# Altium schematic sheet nixie_board.SCHDOC
size A2
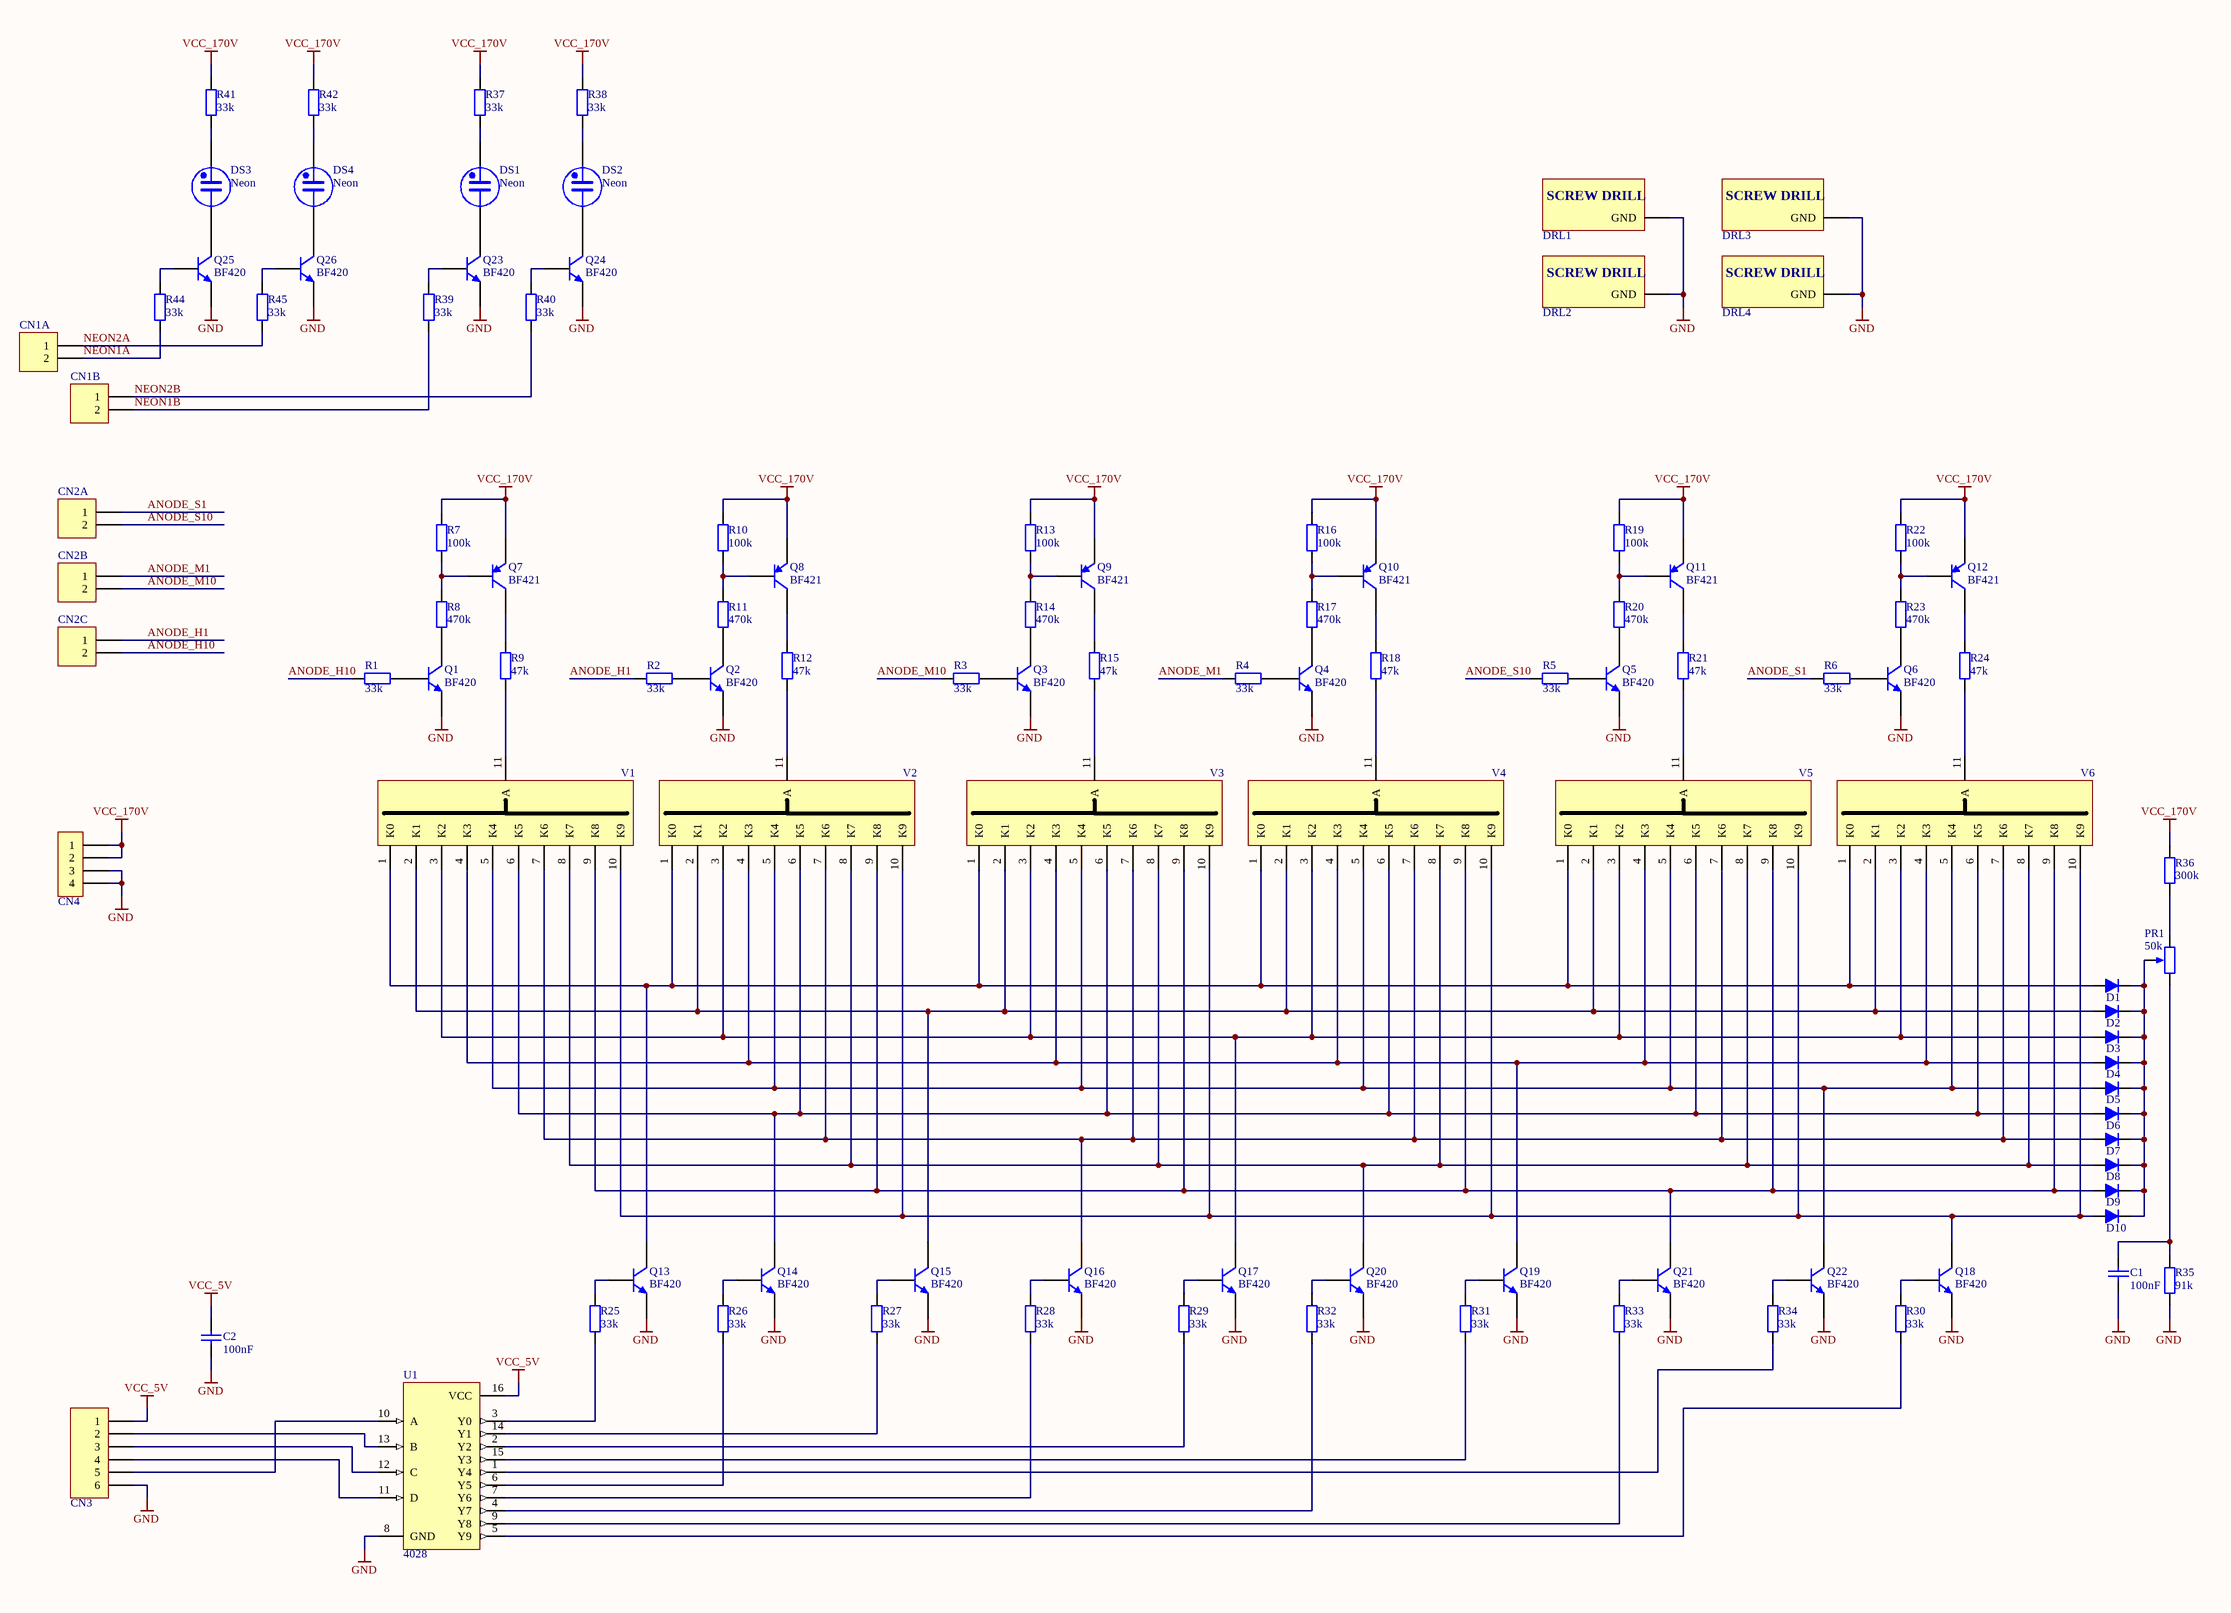
[diagram p0: nixie_board.SCHDOC]

## Parts
C1  100nF  [C-RM5]
C2  100nF  [C-RM5]
CN1A  (no value)  [GP2x1_maual]
CN1B  (no value)  [GP2x1_maual]
CN2A  (no value)  [GP2x1_maual]
CN2B  (no value)  [GP2x1_maual]
CN2C  (no value)  [GP2x1_maual]
CN3  GP 6X1  [GP6x1_manual]  (value not drawn)
CN4  (no value)  [GP4x1_MANUAL]
D1  (no value)  [DO35_LONG]
D2  (no value)  [DO35_LONG]
D3  (no value)  [DO35_LONG]
D4  (no value)  [DO35_LONG]
D5  (no value)  [DO35_LONG]
D6  (no value)  [DO35_LONG]
D7  (no value)  [DO35_LONG]
D8  (no value)  [DO35_LONG]
D9  (no value)  [DO35_LONG]
D10  (no value)  [DO35_LONG]
DRL1  SCREW DRILL  [3mm screw drill I]  (value not drawn)
DRL2  SCREW DRILL  [3mm screw drill I]  (value not drawn)
DRL3  SCREW DRILL  [3mm screw drill I]  (value not drawn)
DRL4  SCREW DRILL  [3mm screw drill I]  (value not drawn)
DS1  Neon  [NEON_6mm]
DS2  Neon  [NEON_6mm]
DS3  Neon  [NEON_6mm]
DS4  Neon  [NEON_6mm]
PR1  50k  [CA6V]
Q1  BF420  [TO-92]
Q2  BF420  [TO-92]
Q3  BF420  [TO-92]
Q4  BF420  [TO-92]
Q5  BF420  [TO-92]
Q6  BF420  [TO-92]
Q7  BF421  [TO-92]
Q8  BF421  [TO-92]
Q9  BF421  [TO-92]
Q10  BF421  [TO-92]
Q11  BF421  [TO-92]
Q12  BF421  [TO-92]
Q13  BF420  [TO-92]
Q14  BF420  [TO-92]
Q15  BF420  [TO-92]
Q16  BF420  [TO-92]
Q17  BF420  [TO-92]
Q18  BF420  [TO-92]
Q19  BF420  [TO-92]
Q20  BF420  [TO-92]
Q21  BF420  [TO-92]
Q22  BF420  [TO-92]
Q23  BF420  [TO-92]
Q24  BF420  [TO-92]
Q25  BF420  [TO-92]
Q26  BF420  [TO-92]
R1  33k  [R10-2]
R2  33k  [R10-2]
R3  33k  [R10-2]
R4  33k  [R10-2]
R5  33k  [R10-2]
R6  33k  [R10-2]
R7  100k  [R10-2]
R8  470k  [R10-2]
R9  47k  [R10-2]
R10  100k  [R10-2]
R11  470k  [R10-2]
R12  47k  [R10-2]
R13  100k  [R10-2]
R14  470k  [R10-2]
R15  47k  [R10-2]
R16  100k  [R10-2]
R17  470k  [R10-2]
R18  47k  [R10-2]
R19  100k  [R10-2]
R20  470k  [R10-2]
R21  47k  [R10-2]
R22  100k  [R10-2]
R23  470k  [R10-2]
R24  47k  [R10-2]
R25  33k  [R10-2]
R26  33k  [R10-2]
R27  33k  [R10-2]
R28  33k  [R10-2]
R29  33k  [R10-2]
R30  33k  [R10-2]
R31  33k  [R10-2]
R32  33k  [R10-2]
R33  33k  [R10-2]
R34  33k  [R10-2]
R35  91k  [R10-2]
R36  300k  [R10-2]
R37  33k  [R10-2]
R38  33k  [R10-2]
R39  33k  [R10-2]
R40  33k  [R10-2]
R41  33k  [R10-2]
R42  33k  [R10-2]
R44  33k  [R10-2]
R45  33k  [R10-2]
U1  4028  [DIP16_MANUAL]
V1  Nixie Tube  [LC516_NIXIE_TUBE]  (value not drawn)
V2  Nixie Tube  [LC516_NIXIE_TUBE]  (value not drawn)
V3  Nixie Tube  [LC516_NIXIE_TUBE]  (value not drawn)
V4  Nixie Tube  [LC516_NIXIE_TUBE]  (value not drawn)
V5  Nixie Tube  [LC516_NIXIE_TUBE]  (value not drawn)
V6  Nixie Tube  [LC516_NIXIE_TUBE]  (value not drawn)

## Nets
GND: C1.1 C2.1 CN3.6 CN4.3 CN4.4 DRL1.0(GND) DRL2.0(GND) DRL3.0(GND) DRL4.0(GND) Q1.1(E) Q2.1(E) Q3.1(E) Q4.1(E) Q5.1(E) Q6.1(E) Q13.1(E) Q14.1(E) Q15.1(E) Q16.1(E) Q17.1(E) Q18.1(E) Q19.1(E) Q20.1(E) Q21.1(E) Q22.1(E) Q23.1(E) Q24.1(E) Q25.1(E) Q26.1(E) R35.1 U1.8(GND)
VCC_5V: C2.2 CN3.1 U1.16(VCC)
VCC_170V: CN4.1 CN4.2 Q7.1(E) Q8.1(E) Q9.1(E) Q10.1(E) Q11.1(E) Q12.1(E) R7.2 R10.2 R13.2 R16.2 R19.2 R22.2 R36.2 R37.2 R38.2 R41.2 R42.2
ANODE_H1: CN2C.1 R2.1
ANODE_H10: CN2C.2 R1.1
ANODE_M1: CN2B.1 R4.1
ANODE_M10: CN2B.2 R3.1
ANODE_S1: CN2A.1 R6.1
ANODE_S10: CN2A.2 R5.1
NEON1A: CN1A.2 R44.2
NEON1B: CN1B.2 R39.2
NEON2A: CN1A.1 R45.2
NEON2B: CN1B.1 R40.2
NetC1_2: C1.2 PR1.2(BOT) R35.2
NetCN3_2: CN3.2 U1.13(B)
NetCN3_3: CN3.3 U1.12(C)
NetCN3_4: CN3.4 U1.11(D)
NetCN3_5: CN3.5 U1.10(A)
NetD1_1: D1.1(A) Q13.2(C) V1.1(K0) V2.1(K0) V3.1(K0) V4.1(K0) V5.1(K0) V6.1(K0)
NetD1_2: D1.2(K) D2.2(K) D3.2(K) D4.2(K) D5.2(K) D6.2(K) D7.2(K) D8.2(K) D9.2(K) D10.2(K) PR1.3(TAP)
NetD2_1: D2.1(A) Q15.2(C) V1.2(K1) V2.2(K1) V3.2(K1) V4.2(K1) V5.2(K1) V6.2(K1)
NetD3_1: D3.1(A) Q17.2(C) V1.3(K2) V2.3(K2) V3.3(K2) V4.3(K2) V5.3(K2) V6.3(K2)
NetD4_1: D4.1(A) Q19.2(C) V1.4(K3) V2.4(K3) V3.4(K3) V4.4(K3) V5.4(K3) V6.4(K3)
NetD5_1: D5.1(A) Q22.2(C) V1.5(K4) V2.5(K4) V3.5(K4) V4.5(K4) V5.5(K4) V6.5(K4)
NetD6_1: D6.1(A) Q14.2(C) V1.6(K5) V2.6(K5) V3.6(K5) V4.6(K5) V5.6(K5) V6.6(K5)
NetD7_1: D7.1(A) Q16.2(C) V1.7(K6) V2.7(K6) V3.7(K6) V4.7(K6) V5.7(K6) V6.7(K6)
NetD8_1: D8.1(A) Q20.2(C) V1.8(K7) V2.8(K7) V3.8(K7) V4.8(K7) V5.8(K7) V6.8(K7)
NetD9_1: D9.1(A) Q21.2(C) V1.9(K8) V2.9(K8) V3.9(K8) V4.9(K8) V5.9(K8) V6.9(K8)
NetD10_1: D10.1(A) Q18.2(C) V1.10(K9) V2.10(K9) V3.10(K9) V4.10(K9) V5.10(K9) V6.10(K9)
NetDS1_1: DS1.1 R37.1
NetDS1_2: DS1.2 Q23.2(C)
NetDS2_1: DS2.1 R38.1
NetDS2_2: DS2.2 Q24.2(C)
NetDS3_1: DS3.1 R41.1
NetDS3_2: DS3.2 Q25.2(C)
NetDS4_1: DS4.1 R42.1
NetDS4_2: DS4.2 Q26.2(C)
NetPR1_1: PR1.1(TOP) R36.1
NetQ1_2: Q1.2(C) R8.1
NetQ1_3: Q1.3(B) R1.2
NetQ2_2: Q2.2(C) R11.1
NetQ2_3: Q2.3(B) R2.2
NetQ3_2: Q3.2(C) R14.1
NetQ3_3: Q3.3(B) R3.2
NetQ4_2: Q4.2(C) R17.1
NetQ4_3: Q4.3(B) R4.2
NetQ5_2: Q5.2(C) R20.1
NetQ5_3: Q5.3(B) R5.2
NetQ6_2: Q6.2(C) R23.1
NetQ6_3: Q6.3(B) R6.2
NetQ7_2: Q7.2(C) R9.2
NetQ7_3: Q7.3(B) R7.1 R8.2
NetQ8_2: Q8.2(C) R12.2
NetQ8_3: Q8.3(B) R10.1 R11.2
NetQ9_2: Q9.2(C) R15.2
NetQ9_3: Q9.3(B) R13.1 R14.2
NetQ10_2: Q10.2(C) R18.2
NetQ10_3: Q10.3(B) R16.1 R17.2
NetQ11_2: Q11.2(C) R21.2
NetQ11_3: Q11.3(B) R19.1 R20.2
NetQ12_2: Q12.2(C) R24.2
NetQ12_3: Q12.3(B) R22.1 R23.2
NetQ13_3: Q13.3(B) R25.2
NetQ14_3: Q14.3(B) R26.2
NetQ15_3: Q15.3(B) R27.2
NetQ16_3: Q16.3(B) R28.2
NetQ17_3: Q17.3(B) R29.2
NetQ18_3: Q18.3(B) R30.2
NetQ19_3: Q19.3(B) R31.2
NetQ20_3: Q20.3(B) R32.2
NetQ21_3: Q21.3(B) R33.2
NetQ22_3: Q22.3(B) R34.2
NetQ23_3: Q23.3(B) R39.1
NetQ24_3: Q24.3(B) R40.1
NetQ25_3: Q25.3(B) R44.1
NetQ26_3: Q26.3(B) R45.1
NetR9_1: R9.1 V1.11(A)
NetR12_1: R12.1 V2.11(A)
NetR15_1: R15.1 V3.11(A)
NetR18_1: R18.1 V4.11(A)
NetR21_1: R21.1 V5.11(A)
NetR24_1: R24.1 V6.11(A)
NetR25_1: R25.1 U1.3(Y0)
NetR26_1: R26.1 U1.6(Y5)
NetR27_1: R27.1 U1.14(Y1)
NetR28_1: R28.1 U1.7(Y6)
NetR29_1: R29.1 U1.2(Y2)
NetR30_1: R30.1 U1.5(Y9)
NetR31_1: R31.1 U1.15(Y3)
NetR32_1: R32.1 U1.4(Y7)
NetR33_1: R33.1 U1.9(Y8)
NetR34_1: R34.1 U1.1(Y4)

## Library data of the parts
C1 C2 = Cap: Capacitor; Published: 19-Feb-2006; Value: 100nF
CN1A CN1B CN2A CN2B CN2C = GP 2X1: Goldpin, 2-Pin; Published: 27-Jun-2006
CN3 = GP 6X1: Gold Pin, 6-Pin
CN4 = GP 4X1: Gold Pin, 4-Pin
D1-D10 = BAVP21: Fast rectifier diode: 250V 0.25A, <50ns DO35; Published: 26-Mar-2006
DS1-DS4 = Neon: Neon Bulb; Published: 24-Mar-1999; Revision: July-2002: Re-released for DXP Platform.; Publisher: Altium Limited
PR1 = RPot: Potentiometer; Published: 03-Apr-2006; Value: 50k
Q1-Q6 Q13-Q26 = BF420: NPN Transistor, 300V, 0.1A, 0.83W; Published: 14-Sep-2006
Q7-Q12 = BF421: PNP Transistor, 300V, 0.1A, 0.83W; Published: 14-Sep-2006
R1-R42 R44 R45 = Res: Resistor; Published: 19-Feb-2006
  R1-R6 R25-R34 R37-R42 R44 R45: Value: 33k
  R7 R10 R13 R16 R19 R22: Value: 100k
  R8 R11 R14 R17 R20 R23: Value: 470k
  R9 R12 R15 R18 R21 R24: Value: 47k
  R35: Value: 91k
  R36: Value: 300k
U1 = 4028: BCD-to-Decimal Decoder; Package Information: Latest Revision: Sep-1988; Published: 8-Jun-2000; Revision: 17-Jul-2002: Re-released for DXP Platform.; Datasheet: Latest Revision: Jun-1989; Package Reference: CDIP16; Publisher: Altium Limited
V1-V6 = LC516: LC-516 Nixie Tube